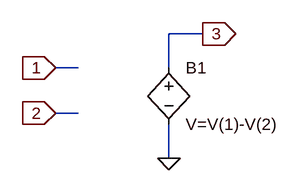
[diagram p0: schematic subtractor.asc]
subtractor.asc, the LTspice schematic file:
Version 4
SHEET 1 880 680
WIRE 304 96 256 96
WIRE 128 144 96 144
WIRE 256 144 256 96
WIRE 128 208 96 208
WIRE 256 272 256 224
FLAG 96 144 1
IOPIN 96 144 In
FLAG 96 208 2
IOPIN 96 208 In
FLAG 256 272 0
FLAG 304 96 3
IOPIN 304 96 Out
SYMBOL bv 256 128 R0
SYMATTR InstName B1
SYMATTR Value V=V(1)-V(2)

The netlist it stands for:
* subtractor.asc
B1 3 0 V=V(1)-V(2)
.backanno
.end